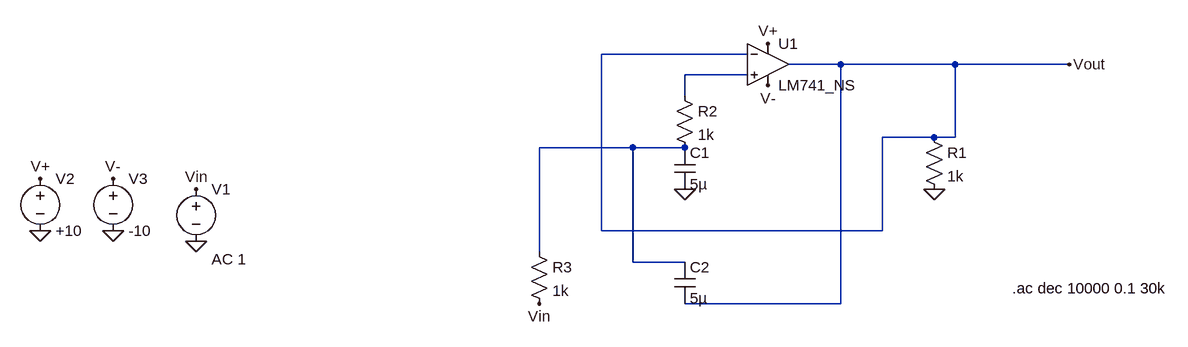
[diagram p0: schematic q3.asc]
q3.asc, the LTspice schematic file:
Version 4
SHEET 1 1032 680
WIRE -48 112 -272 112
WIRE 96 128 16 128
WIRE 272 128 96 128
WIRE 448 128 272 128
WIRE -48 144 -144 144
WIRE -144 176 -144 144
WIRE 240 240 160 240
WIRE 272 240 272 128
WIRE 272 240 240 240
WIRE -224 256 -368 256
WIRE -144 256 -224 256
WIRE -272 384 -272 112
WIRE 160 384 160 240
WIRE 160 384 -272 384
WIRE -368 416 -368 256
WIRE -224 432 -224 256
WIRE -144 432 -224 432
WIRE 96 496 96 128
WIRE 96 496 -144 496
FLAG -896 400 0
FLAG -1024 384 0
FLAG -1136 384 0
FLAG -896 320 Vin
FLAG -1136 304 V+
FLAG -1024 304 V-
FLAG -16 96 V+
FLAG -16 160 V-
FLAG 240 320 0
FLAG -144 320 0
FLAG -368 496 Vin
FLAG 448 128 Vout
SYMBOL AutoGenerated\\LM741_NS -16 64 R0
SYMATTR InstName U1
SYMBOL voltage -896 304 R0
WINDOW 123 24 124 Left 2
WINDOW 39 0 0 Left 2
SYMATTR InstName V1
SYMATTR Value ""
SYMATTR Value2 AC 1
SYMBOL voltage -1136 288 R0
WINDOW 123 0 0 Left 2
WINDOW 39 0 0 Left 2
SYMATTR InstName V2
SYMATTR Value +10
SYMBOL voltage -1024 288 R0
WINDOW 123 0 0 Left 2
WINDOW 39 0 0 Left 2
SYMATTR InstName V3
SYMATTR Value -10
SYMBOL res 224 224 R0
SYMATTR InstName R1
SYMATTR Value 1k
SYMBOL res -160 160 R0
SYMATTR InstName R2
SYMATTR Value 1k
SYMBOL res -384 400 R0
SYMATTR InstName R3
SYMATTR Value 1k
SYMBOL cap -160 256 R0
SYMATTR InstName C1
SYMATTR Value 5µ
SYMBOL cap -160 432 R0
SYMATTR InstName C2
SYMATTR Value 5µ
TEXT 360 472 Left 2 !.ac dec 10000 0.1 30k

The netlist it stands for:
* q3.asc
* U1: LM741_NS (symbol AutoGenerated\LM741_NS not available, pins judged from their places): In+=N001 In-=Vout V+=V+ V-=V- OUT=Vout
V1 Vin 0 AC 1
V2 V+ 0 +10
V3 V- 0 -10
R1 Vout 0 1k
R2 N001 N002 1k
R3 N002 Vin 1k
C1 N002 0 5µ
C2 N002 Vout 5µ
.ac dec 10000 0.1 30k
.backanno
.end